# Altium project PCB_Project_Luca.PrjPcb
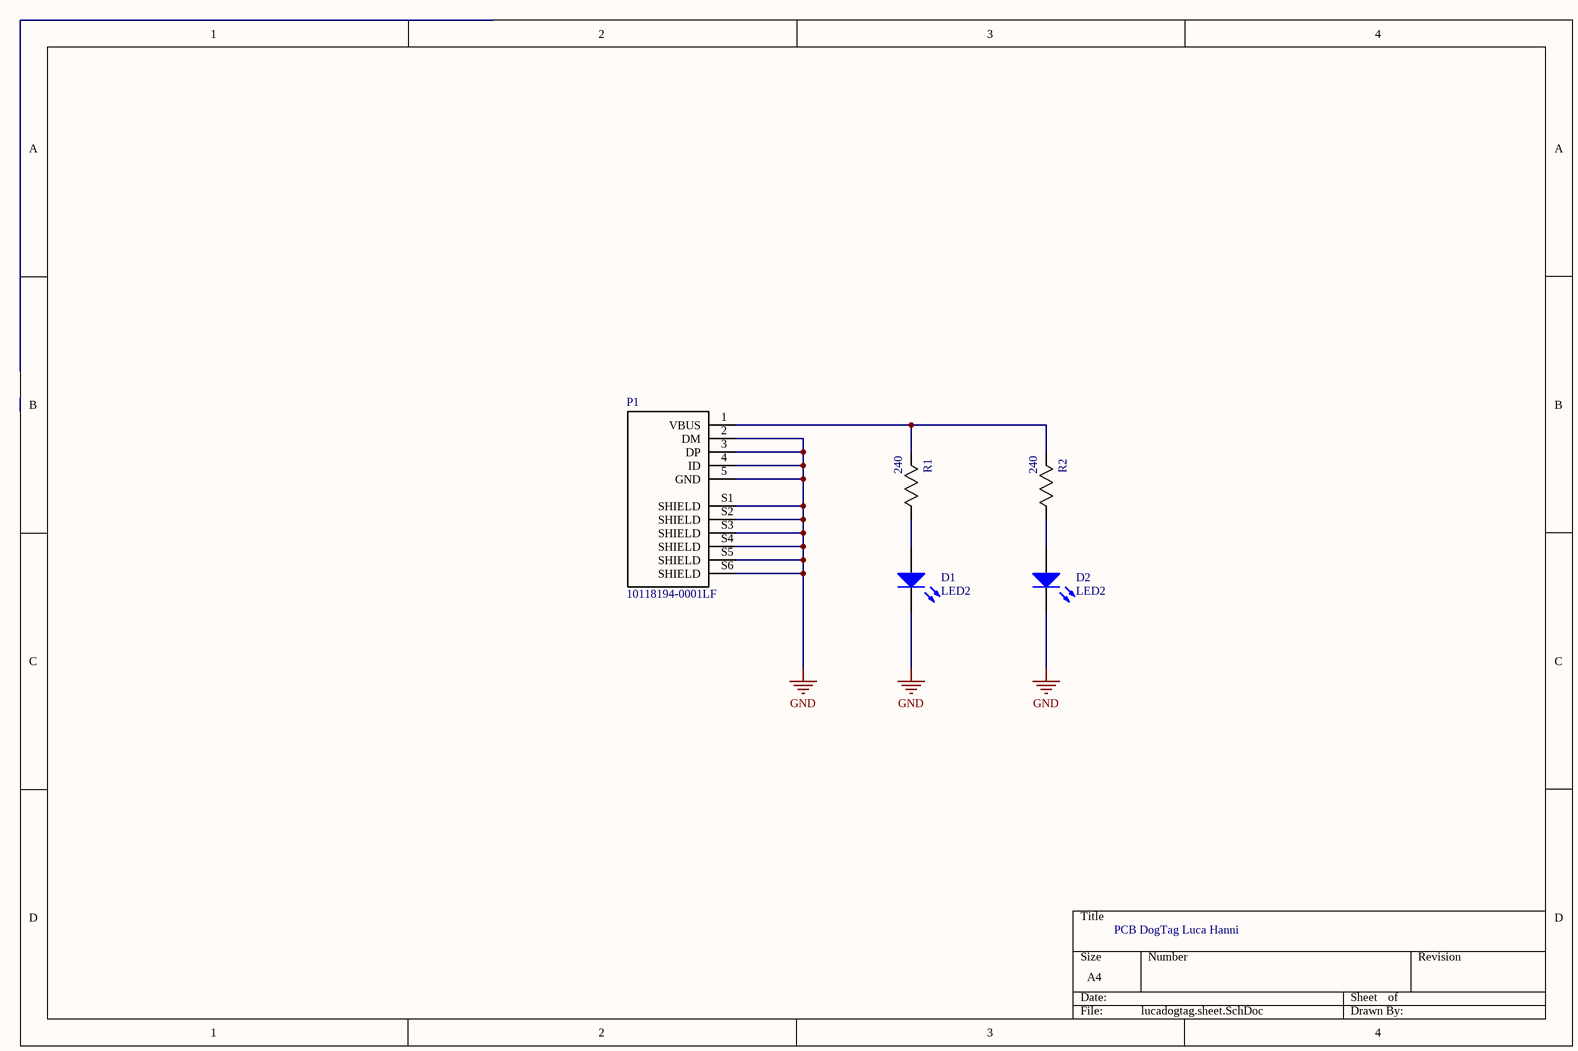
[diagram p0: lucadogtag.sheet.SchDoc]
1 sheet, 5 parts. Net scope: global (net labels, ports and power ports of the same name join across sheets).
Board file: PCBLUCA.PcbDoc

## Sheet lucadogtag.sheet.SchDoc
size A4; SheetNumber: 1; SheetTotal: 1

### Parts
D1  LED2  [3.2X1.6X1.1]
D2  LED2  [3.2X1.6X1.1]
P1  10118194-0001LF  [USB Micro B Receptacle]
R1  240  [0805]
R2  240  [0805]

### Nets
GND: D1.2(K) D2.2(K) P1.2(DM) P1.3(DP) P1.4(ID) P1.5(GND) P1.S1(SHIELD) P1.S2(SHIELD) P1.S3(SHIELD) P1.S4(SHIELD) P1.S5(SHIELD) P1.S6(SHIELD)
NetD1_1: D1.1(A) R1.1(R1)
NetD2_1: D2.1(A) R2.1(R1)
NetP1_1: P1.1(VBUS) R1.2(R2) R2.2(R2)

### Notes on the sheet
- PCB DogTag Luca Hanni

### Library data of the parts
D1 D2 = LED2: Typical RED, GREEN, YELLOW, AMBER GaAs LED; Published: 8-Jun-2000; LatestRevisionDate: 17-Jul-2002; LatestRevisionNote: Re-released for DXP Platform.; PackageVersion: Feb-2002; PackageReference: 3.2X1.6X1.1; Publisher: Altium Limited; PackageDescription: SM LED; 2 Flat Leads
P1 = USB Micro B Receptacle: USB - micro B USB 2.0 Receptacle Connector 5 Position Surface Mount, Right Angle; Through Hole; MF: Amphenol ICC (FCI); Rating: 100VAC 1.8A; Digikey: 609-4618-1-ND; Digikey Link: https://www.digikey.ca/product-detail/en/amphenol-icc-fci/10118194-0001LF/609-4618-1-ND/2785382; MP: 10118194-0001LF; Price: 0.62000 CAD; ComponentLink1Description: Digikey; ComponentLink1URL: https://www.digikey.ca/product-detail/en/amphenol-icc-fci/10118194-0001LF/609-4618-1-ND/2785382; ComponentLink2Description: Datasheet; ComponentLink2URL: https://www.digikey.ca/en/datasheets/amphenol-fci/amphenol-fci-io-usb-micro
R1 R2 = RES 240.0 1/8W: RES SMD 240 OHM 5% 1/8W 0805; Power (Watts): 0.125W; Package: 0805; Value: 240; Tolerance: 5%